# Altium schematic sheet Nixie_PSU.SchDoc
size A; SheetNumber: 1; SheetTotal: 5
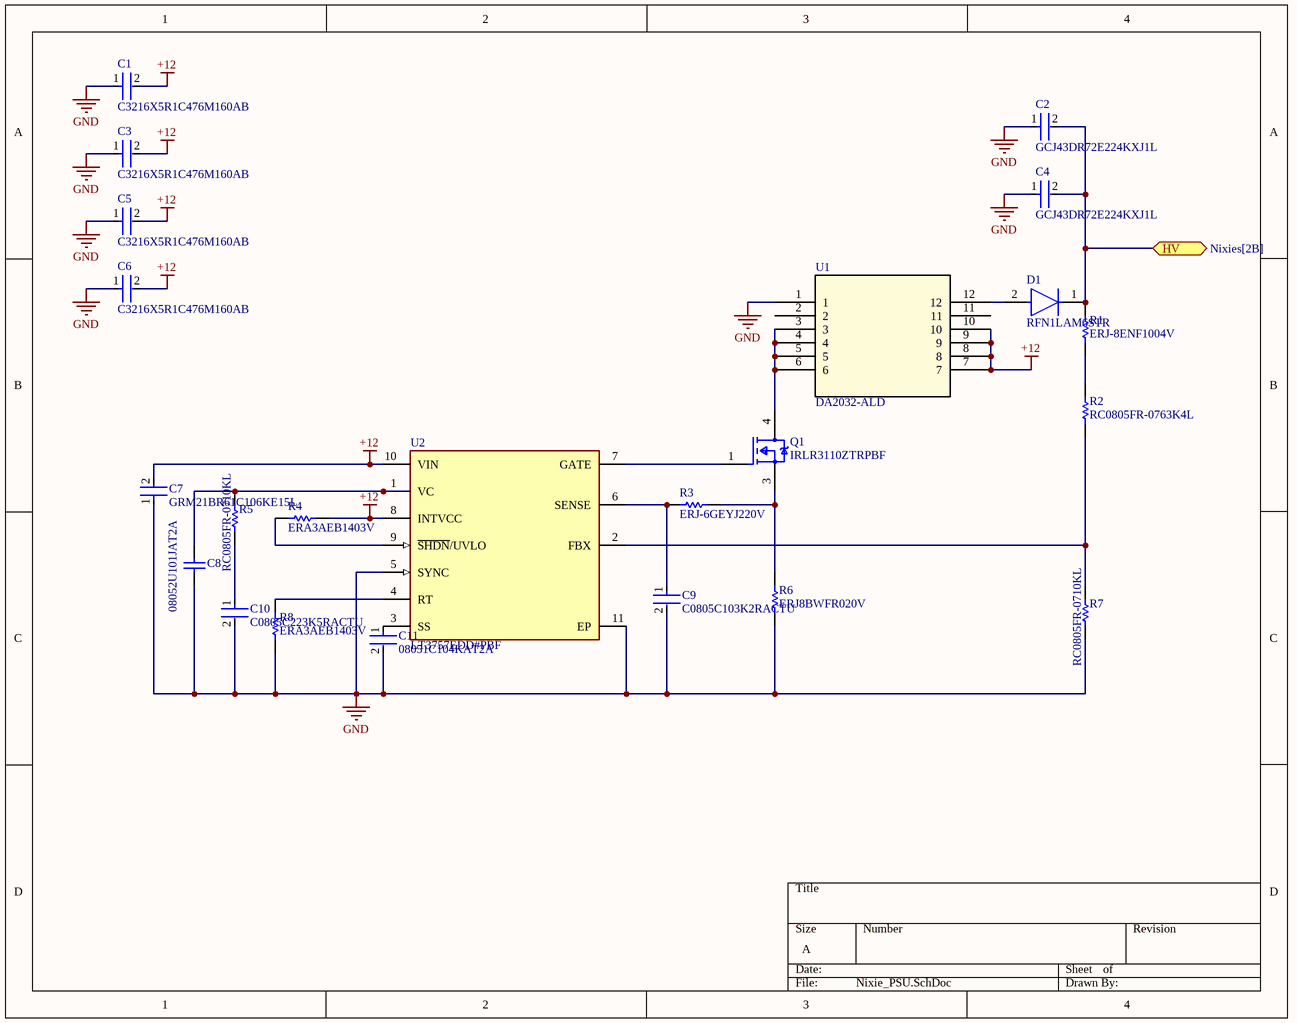
[diagram p0: Nixie_PSU.SchDoc]

## Parts
C1  C3216X5R1C476M160AB  [FP-C3216-160-0_2-MFG]
C2  GCJ43DR72E224KXJ1L  [FP-GCJ43D-0_4-IPC_C]
C3  C3216X5R1C476M160AB  [FP-C3216-160-0_2-MFG]
C4  GCJ43DR72E224KXJ1L  [FP-GCJ43D-0_4-IPC_C]
C5  C3216X5R1C476M160AB  [FP-C3216-160-0_2-MFG]
C6  C3216X5R1C476M160AB  [FP-C3216-160-0_2-MFG]
C7  GRM21BR61C106KE15L  [FP-GRM21B-0_1-IPC_C]
C8  08052U101JAT2A  [CAPC2013X115X51ML20T26]
C9  C0805C103K2RACTU  [FP-C0805C-DN-MFG]
C10  C0805C223K5RACTU  [FP-C0805C-DN-MFG]
C11  08051C104KAT2A  [FP-0805-L_2_01_0_2-W_1_25-IPC_B]
D1  RFN1LAM6STR  [FP-PMDTM-MFG]
Q1  IRLR3110ZTRPBF  [FP-PG-TO252-3-MFG]
R1  ERJ-8ENF1004V  [RESC3216X70X50NL05T20]
R2  RC0805FR-0763K4L  [RESC2013X60X35NL10T20]
R3  ERJ-6GEYJ220V  [RESC2013X70X40ML20T20]
R4  ERA3AEB1403V  [RESC1608X55X30LL20T20]
R5  RC0805FR-0710KL  [RESC2013X60X35NL10T20]
R6  ERJ8BWFR020V  [RESC3216X70X50LL05T20]
R7  RC0805FR-0710KL  [RESC2013X60X35NL10T20]
R8  ERA3AEB1403V  [RESC1608X55X30LL20T20]
U1  DA2032-ALD  [SOIC12_LT3750_DA2032_14P98X17P2_COC]
U2  LT3757EDD#PBF  [FP-DD-10-05-08-1699-IPC_A]

## Ports
HV (bidir, see Nixies[2B])

## Nets
+12: C1.2 C3.2 C5.2 C6.2 C7.2 R4.1 U1.7 U1.8 U1.9 U1.10 U2.8(INTVCC) U2.10(VIN)
GND: C1.1 C2.1 C3.1 C4.1 C5.1 C6.1 C7.1 C8.1 C9.2 C10.2 C11.2 R6.1 R7.1 R8.2 U1.1 U2.5(SYNC) U2.11(EP)
HV: C2.2 C4.2 D1.1(C) R1.2 ; port HV
NetC8_2: C8.2 R5.2 U2.1(VC)
NetC9_1: C9.1 R3.1 U2.6(SENSE)
NetC10_1: C10.1 R5.1
NetC11_1: C11.1 U2.3(SS)
NetD1_2: D1.2(A) U1.12
NetQ1_1: Q1.1(G) U2.7(GATE)
NetQ1_3: Q1.3(S) R3.2 R6.2
NetQ1_4: Q1.4(D) U1.3 U1.4 U1.5 U1.6
NetR1_1: R1.1 R2.2
NetR2_1: R2.1 R7.2 U2.2(FBX)
NetR4_2: R4.2 U2.9(~{SHDN}/UVLO)
NetR8_1: R8.1 U2.4(RT)

Not connected (* = marked no-connect by the designer): U1 2 11

## Library data of the parts
C1 C3 C5 C6 = CMP-2000-07442-2: Multilayer Ceramic Capacitors 47uF ±20% 16V X5R SMD 1206; Resistor Type: Ceramic; Width: 0.063inch; Case Code (Imperial): 1206; Radiation Hardening: No; Thickness: 0.071inch; Dielectric: X5R; Weight: 0.000571oz; Termination: SMD/SMT; Dielectric Material: Ceramic; Min Operating Temperature: -55°C; Depth: 1.6mm; Case Code (Metric): 3216; Max Operating Temperature: 85°C; RoHS Compliant: Yes; REACH SVHC: No SVHC; Mount: Surface Mount; Lead Free: Lead Free; Height: 1.6mm; Length: 3.2mm; Tolerance: 20%; Voltage Rating (DC): 16V; Capacitance: 47uF; Package Quantity: 1; Construction: Flat; Packaging: Tape and Reel; Series: C; Case/Package: 1206; Voltage Rating: 16V
C2 C4 = CMP-06035-007963-1: 0.22uF ±10% 250V Ceramic Capacitor X7R 1812 (4532 Metric); Capacitance: 220nF; Ratings: AEC-Q200; Dielectric: X7R; Voltage Rating: 250V; Termination: SMD/SMT; Tolerance: 10%; Width: 0.126inch; Length: 4.5mm; Radiation Hardening: No; Case Code (Metric): 4532; Voltage Rating (DC): 250V; Depth: 3.2mm; Features: Soft Termination; Mount: Surface Mount; Thickness: 0.079inch; REACH SVHC: No SVHC; Max Operating Temperature: 125°C; Package Quantity: 1; Case Code (Imperial): 1812; Min Operating Temperature: -55°C; Packaging: Tape and Reel; Case/Package: 1812; Height: 2mm
C7 = CMP-2007-03453-2: Chip Multilayer Ceramic Capacitors for General Purpose, 0805, 10uF, X5R, 15%, 10%, 16V; Radiation Hardening: No; Thickness: 0.053inch; Voltage Rating (DC): 16V; Lead Free: Lead Free; Package Quantity: 1; Width: 1.25mm; Case Code (Imperial): 0805; Depth: 1.25mm; Packaging: Tape and Reel; Dielectric: X5R; Max Operating Temperature: 85°C; Tolerance: 10%; Voltage Rating: 16V; Voltage: 16V; Capacitance: 10uF; Height: 1.25mm; Case Code (Metric): 2012; Material: Ceramic; Mount: Surface Mount; Case/Package: 0805; REACH SVHC: No SVHC; Length: 2mm; Min Operating Temperature: -55°C; Termination: SMD/SMT
C8 = CMP-2007-04861-1: Manufacturer: AVX Interconnect / Elco; Part Number: 08052U101JAT2A
C9 = CMP-2007-00259-2: CAP CER 10000PF 200V X7R 0805; Manufacturer: KEMET; Material: Ceramic; Temperature Coefficient: 30ppm/°C; Capacitance: 10,000 pF; Tolerance: 0.1; Value: 10,000 pF; Device Class L2: Capacitors; Voltage Rating: 200 V; Temperature Range High: +125°C; ComponentLink2Description: Datasheet; Height: 0.88mm; Octopart: https://octopart.com/c0805c103k2ractu-kemet-9138347; ComponentLink2URL: https://content.kemet.com/datasheets/KEM_C1003_C0G_SMD.pdf; Category: Cap; Temperature: -55°C to +125°C; Temperature Range Low: -55°C; Digikey Description: CAP CER 10000PF 200V X7R 0805; Manufacturer Part Number: C0805C103K2RACTU; Temperature Characteristic: X7R; Automotive: No; Device Class L3: Ceramic Capacitors; Mouser Description: KEMET - C0805C103K2RACTU - CAP, MLCC, X7R, 10NF, 200V, 0805; RoHS: TRUE; Device Class L1: Passive Components; Lead Free: Yes; Package: C0805C-DN; Ipc Land Pattern Name: CAPC200125X78
C10 = CMP-2007-00338-2: CAP CER 0.022UF 50V X7R 0805; Manufacturer: KEMET; Value: 22,000 pF; Material: Ceramic; Tolerance: 0.1; Temperature Coefficient: 30ppm/°C; Automotive: No; Package: C0805C-DN; RoHS: TRUE; Height: 0.88mm; Lead Free: Yes; Temperature Range Low: -55°C; Digikey Description: CAP CER 0.022UF 50V X7R 0805; ComponentLink2Description: Datasheet; Capacitance: 22,000 pF; Mouser Description: Capacitor; Ceramic; Cap; .022uF; Tol 10%; SMT; Vol-Rtg 50V; X7R; Tape and Reel; Device Class L3: Ceramic Capacitors; Category: Cap; Voltage Rating: 50 V; Temperature Characteristic: X7R; Ipc Land Pattern Name: CAPC200125X78; Manufacturer Part Number: C0805C223K5RACTU; Octopart: https://octopart.com/c0805c223k5ractu-kemet-145968; Device Class L1: Passive Components; Temperature: -55°C to +125°C; ComponentLink2URL: https://content.kemet.com/datasheets/KEM_C1003_C0G_SMD.pdf; Temperature Range High: +125°C; Device Class L2: Capacitors
C11 = CMP-2007-04174-2: General Purpose Ceramic Capacitor, 0805, 100nF, 10%, X7R, 15%, 100V; Packaging: Tape and Reel; Min Operating Temperature: -55°C; Dielectric Material: Ceramic; Height: 1.4mm; Voltage Rating: 100V; Termination: SMD/SMT; Case Code (Imperial): 0805; Case Code (Metric): 2012; Case/Package: 0805; Construction: Flat; Radiation Hardening: No; Series: -; Dielectric: X7R; Package Quantity: 2000; Mount: Surface Mount; Capacitance: 100nF; Contact Plating: Tin; Voltage: 100V; Lead Free: Lead Free; Depth: 1.25mm; RoHS Compliant: Yes; Number of Pins: 2; Max Operating Temperature: 125°C; Length: 2.01mm; Voltage Rating (DC): 100V; Thickness: 0.055inch; REACH SVHC: No SVHC; Width: 0.049inch; Tolerance: 10%
D1 = CMP-08972-000003-1: DIODE GEN PURP 600V 800MA PMDTM; Manufacturer: Rohm; Max Junction Temp: +150°C; Forward Current: 0.8A; Max Surge Forward Current: 15A; Peak Reverse Current: 1uA; Lead Free: Yes; ComponentLink2Description: Datasheet; Manufacturer Part Number: RFN1LAM6STR; Height: 1.05mm; Temperature: to +150°C; Device Class L2: Diodes; Temperature Range High: +150°C; ComponentLink2URL: https://www.rohm.com/datasheet/RFN1LAM6S/rfn1lam6s-e; Reverse Voltage: 600V; Category: Diode; Automotive: No; Octopart: https://octopart.com/rfn1lam6str-rohm-81877486; Package: PMDTM; Device Class L3: Rectifier Diodes; Max Repetitive Reverse Voltage: 600V; Device Class L1: Discrete Semiconductors; RoHS: TRUE; Digikey Description: DIODE GEN PURP 600V 800MA PMDTM
Q1 = CMP-32901-000150-1: MOSFET N-CH 100V 42A DPAK; Manufacturer: Infineon; Turn Off Delay Time: 33ns; Drain To Source Resistance: 12mΩ; Max Forward Diode Voltage: 1.3V; Reverse Recovery Time: 34ns; Number Of N Channels: 1; Power Dissipation: 140W; Turn On Delay Time: 24ns; Input Capacitace At Vds: 3980pF @ 25V; Max Junction Temp: +175°C; Rthja Max: 40°C/W; Threshold Vgs Max: 2.5V; Threshold Vgs Min: 1V; Reverse Recovery Charge: 42nC; Gate Charge At Vgs: 34nC @ 4.5V; Gate To Source Voltage: 16V; Depletion Mode: False; Pulse Drain Current: 250A; Drain To Source Breakdown Voltage: 100V; Temperature Range Low: -55°C; Continuous Drain Current: 42A; Temperature: -55°C to +175°C; Automotive: No; Footprint Url: https://www.infineon.com/dgdl/po-dpak.pdf?fileId=5546d462580663ef0158068dbd7a01d5; Package: PG-TO252-3; Drain To Source Voltage: 100V; ComponentLink2Description: Datasheet; Device Class L2: Transistors; Lead Free: Yes; Temperature Range High: +175°C; Octopart: https://octopart.com/irlr3110ztrpbf-infineon-65875028; Device Class L1: Discrete Semiconductors; Device Class L3: MOSFETs; RoHS: TRUE; Number Of Channels: 1; Manufacturer Part Number: IRLR3110ZTRPBF; Category: Trans; ComponentLink2URL: https://www.infineon.com/dgdl/irlr3110zpbf.pdf?fileId=5546d462533600a40153566cf6e2268a; Digikey Description: MOSFET N-CH 100V 42A DPAK; Height: 2.52mm
R1 = CMP-2003-00020-1: Manufacturer: Panasonic; Part Number: ERJ-8ENF1004V
R2 = CMP-2001-01229-1: Manufacturer: Yageo; Part Number: RC0805FR-0763K4L
R3 = CMP-2001-00374-1: Manufacturer: Panasonic; Part Number: ERJ-6GEYJ220V
R4 R8 = CMP-2000-00911-1: Manufacturer: Panasonic; Part Number: ERA3AEB1403V
R5 R7 = CMP-1659-00013-4: Chip Resistor, 10 KOhm, +/- 1%, 0.125 W, -55 to 155 degC, 0805 (2012 Metric), RoHS, Tape and Reel; Manufacturer: Yageo; Voltage Rating: 150 V; Mount: Surface Mount; ComponentLink1Description: Manufacturer URL; ComponentLink2URL: http://www.yageo.com/documents/recent/PYu-RC_Group_51_RoHS_L_04.pdf; Pins: 2; Length: 2 mm; Min Operating Temperature: -55 degC; Height: 0.5 mm; Mounting Technology: Surface Mount; RoHSCompliant: true; REACH SVHC: No SVHC; ComponentLink1URL: http://www.yageo.com/; Max Operating Temperature: 155 degC; PackageReference: 0805; DatasheetVersion: Rev. 4, 02/2016; Package Quantity: 5000; Packaging: Tape and Reel; ComponentLink2Description: Datasheet; PackageDescription: 2-Pin Surface Mounted Device, Body 2 x 1.25 mm
R6 = CMP-2003-00770-1: Manufacturer: Panasonic; Part Number: ERJ8BWFR020V
U1 = CMP-080-000000-1: No Description Available; Mfr_Name: Coilcraft; Source: DA2032-ALD.SchLib; RefDes: RefDes; Type: Type; Design Item ID: DA2032-ALD
U2 = CMP-09139-000444-1: IC REG CTRLR MULT TOPOLOGY 10DFN; Max Input Voltage: 40V; Number of Output Phases: 1; Min Supply Voltage: 2.9V; Switching Frequency: 1MHz; Min Output Voltage: 1.569V; Max Output Voltage: 350V; Clock Sync: Yes; Output Current: 25A; Topology: Boost; Max Output Current: 12uA; Synchronous Rectifier: No; Height: 0.7mm; Number of Outputs: 1; Packaging: Rail/Tube; Max Supply Voltage: 40V; Min Operating Temperature: -40°C; Output Voltage: 350V; RoHS Compliant: Yes; Mount: Surface Mount; Number of Pins: 10; REACH SVHC: No SVHC; Width: 3mm; Case/Package: DFN; Min Input Voltage: 2.9V; Package Quantity: 121; Length: 3mm; Max Operating Temperature: 125°C